# EAGLE schematic Boss DC-2 (EAGLE 7.2.0)
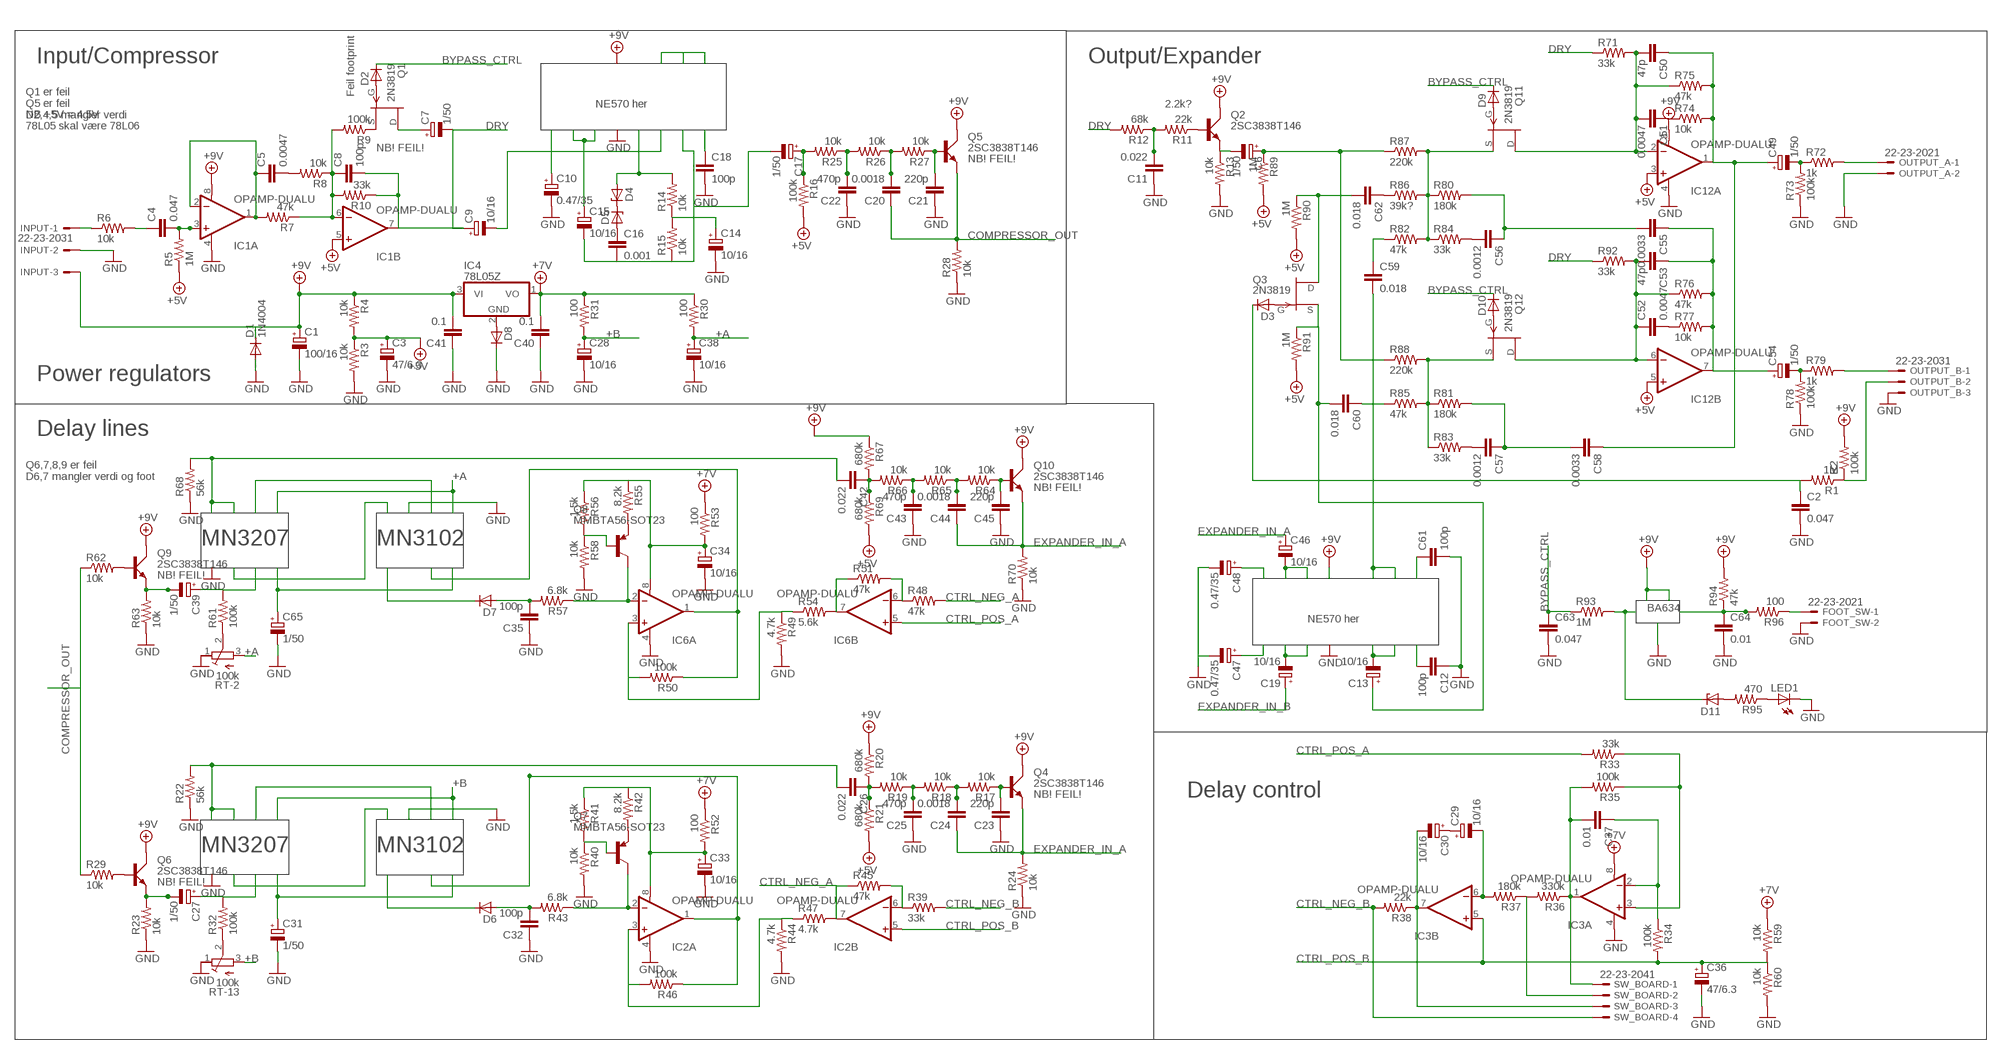
[diagram p0: schematic, sheet 1]

## Parts
C1  100/16  CPOL-EUE2.5-5  [E2,5-5]
C2  0.047  C-EUC0805  [C0805]
C3  47/6.3  CPOL-EUE2.5-5  [E2,5-5]
C4  0.047  C-EUC0805  [C0805]
C5  0.0047  C-EUC0805  [C0805]
C6  1/50  CPOL-EUE2.5-5  [E2,5-5]
C7  1/50  CPOL-EUE2.5-5  [E2,5-5]
C8  100p  C-EUC0805  [C0805]
C9  10/16  CPOL-EUE2.5-5  [E2,5-5]
C10  0.47/35  CPOL-EUE2.5-5  [E2,5-5]
C11  0.022  C-EUC0805  [C0805]
C12  100p  C-EUC0805  [C0805]
C13  10/16  CPOL-EUE2.5-5  [E2,5-5]
C14  10/16  CPOL-EUE2.5-5  [E2,5-5]
C15  10/16  CPOL-EUE2.5-5  [E2,5-5]
C16  0.001  C-EUC0805  [C0805]
C17  1/50  CPOL-EUE2.5-5  [E2,5-5]
C18  100p  C-EUC0805  [C0805]
C19  10/16  CPOL-EUE2.5-5  [E2,5-5]
C20  0.0018  C-EUC0805  [C0805]
C21  220p  C-EUC0805  [C0805]
C22  470p  C-EUC0805  [C0805]
C23  220p  C-EUC0805  [C0805]
C24  0.0018  C-EUC0805  [C0805]
C25  470p  C-EUC0805  [C0805]
C26  0.022  C-EUC0805  [C0805]
C27  1/50  CPOL-EUE2.5-5  [E2,5-5]
C28  10/16  CPOL-EUE2.5-5  [E2,5-5]
C29  10/16  CPOL-EUE2.5-5  [E2,5-5]
C30  10/16  CPOL-EUE2.5-5  [E2,5-5]
C31  1/50  CPOL-EUE2.5-5  [E2,5-5]
C32  100p  C-EUC0805  [C0805]
C33  10/16  CPOL-EUE2.5-5  [E2,5-5]
C34  10/16  CPOL-EUE2.5-5  [E2,5-5]
C35  100p  C-EUC0805  [C0805]
C36  47/6.3  CPOL-EUE2.5-5  [E2,5-5]
C37  0.01  C-EUC0805  [C0805]
C38  10/16  CPOL-EUE2.5-5  [E2,5-5]
C39  1/50  CPOL-EUE2.5-5  [E2,5-5]
C40  0.1  C-EUC0805  [C0805]
C41  0.1  C-EUC0805  [C0805]
C42  0.022  C-EUC0805  [C0805]
C43  470p  C-EUC0805  [C0805]
C44  0.0018  C-EUC0805  [C0805]
C45  220p  C-EUC0805  [C0805]
C46  10/16  CPOL-EUE2.5-5  [E2,5-5]
C47  0.47/35  CPOL-EUE2.5-5  [E2,5-5]
C48  0.47/35  CPOL-EUE2.5-5  [E2,5-5]
C49  1/50  CPOL-EUE2.5-5  [E2,5-5]
C50  47p  C-EUC0805  [C0805]
C51  0.0047  C-EUC0805  [C0805]
C52  0.0047  C-EUC0805  [C0805]
C53  47p  C-EUC0805  [C0805]
C54  1/50  CPOL-EUE2.5-5  [E2,5-5]
C55  0.0033  C-EUC0805  [C0805]
C56  0.0012  C-EUC0805  [C0805]
C57  0.0012  C-EUC0805  [C0805]
C58  0.0033  C-EUC0805  [C0805]
C59  0.018  C-EUC0805  [C0805]
C60  0.018  C-EUC0805  [C0805]
C61  100p  C-EUC0805  [C0805]
C62  0.018  C-EUC0805  [C0805]
C63  0.047  C-EUC0805  [C0805]
C64  0.01  C-EUC0805  [C0805]
C65  1/50  CPOL-EUE2.5-5  [E2,5-5]
D1  1N4004  [DO41-10]
D2  D-SOD-80  [SOD80]
D3  D-SOD-80  [SOD80]
D4  ZENER-DIODESMB  [SMB]
D5  ZENER-DIODESMB  [SMB]
D6  D-SOD-80  [SOD80]
D7  D-SOD-80  [SOD80]
D8  D-SOD-80  [SOD80]
D9  D-SOD-80  [SOD80]
D10  D-SOD-80  [SOD80]
D11  ZENER-DIODESMB  [SMB]
FOOT_SW  22-23-2021  [22-23-2021]
IC1  OPAMP-DUALU  [SO08]
IC2  OPAMP-DUALU  [SO08]
IC3  OPAMP-DUALU  [SO08]
IC4  78L05Z  [TO92]
IC6  OPAMP-DUALU  [SO08]
IC12  OPAMP-DUALU  [SO08]
INPUT  22-23-2031  [22-23-2031]
LED1  LED3MM  [LED3MM]
OUTPUT_A  22-23-2021  [22-23-2021]
OUTPUT_B  22-23-2031  [22-23-2031]
Q1  2N3819  [TO92]
Q2  2SC3838T146  [SC59]
Q3  2N3819  [TO92]
Q4  2SC3838T146  [SC59]
Q5  2SC3838T146  [SC59]
Q6  2SC3838T146  [SC59]
Q7  MMBTA56-SOT23  [SOT23]
Q8  MMBTA56-SOT23  [SOT23]
Q9  2SC3838T146  [SC59]
Q10  2SC3838T146  [SC59]
Q11  2N3819  [TO92]
Q12  2N3819  [TO92]
R1  1M  R-US_R0805  [R0805]
R2  100k  R-US_R0805  [R0805]
R3  10k  R-US_R0805  [R0805]
R4  10k  R-US_R0805  [R0805]
R5  1M  R-US_R0805  [R0805]
R6  10k  R-US_R0805  [R0805]
R7  47k  R-US_R0805  [R0805]
R8  10k  R-US_R0805  [R0805]
R9  100k  R-US_R0805  [R0805]
R10  33k  R-US_R0805  [R0805]
R11  22k  R-US_R0805  [R0805]
R12  68k  R-US_R0805  [R0805]
R13  10k  R-US_R0805  [R0805]
R14  10k  R-US_R0805  [R0805]
R15  10k  R-US_R0805  [R0805]
R16  100k  R-US_R0805  [R0805]
R17  10k  R-US_R0805  [R0805]
R18  10k  R-US_R0805  [R0805]
R19  10k  R-US_R0805  [R0805]
R20  680k  R-US_R0805  [R0805]
R21  680k  R-US_R0805  [R0805]
R22  56k  R-US_R0805  [R0805]
R23  10k  R-US_R0805  [R0805]
R24  10k  R-US_R0805  [R0805]
R25  10k  R-US_R0805  [R0805]
R26  10k  R-US_R0805  [R0805]
R27  10k  R-US_R0805  [R0805]
R28  10k  R-US_R0805  [R0805]
R29  10k  R-US_R0805  [R0805]
R30  100  R-US_R0805  [R0805]
R31  100  R-US_R0805  [R0805]
R32  100k  R-US_R0805  [R0805]
R33  33k  R-US_R0805  [R0805]
R34  100k  R-US_R0805  [R0805]
R35  100k  R-US_R0805  [R0805]
R36  330k  R-US_R0805  [R0805]
R37  180k  R-US_R0805  [R0805]
R38  22k  R-US_R0805  [R0805]
R39  33k  R-US_R0805  [R0805]
R40  10k  R-US_R0805  [R0805]
R41  1.5k  R-US_R0805  [R0805]
R42  8.2k  R-US_R0805  [R0805]
R43  6.8k  R-US_R0805  [R0805]
R44  4.7k  R-US_R0805  [R0805]
R45  47k  R-US_R0805  [R0805]
R46  100k  R-US_R0805  [R0805]
R47  4.7k  R-US_R0805  [R0805]
R48  47k  R-US_R0805  [R0805]
R49  4.7k  R-US_R0805  [R0805]
R50  100k  R-US_R0805  [R0805]
R51  47k  R-US_R0805  [R0805]
R52  100  R-US_R0805  [R0805]
R53  100  R-US_R0805  [R0805]
R54  5.6k  R-US_R0805  [R0805]
R55  8.2k  R-US_R0805  [R0805]
R56  1.5k  R-US_R0805  [R0805]
R57  6.8k  R-US_R0805  [R0805]
R58  10k  R-US_R0805  [R0805]
R59  10k  R-US_R0805  [R0805]
R60  10k  R-US_R0805  [R0805]
R61  100k  R-US_R0805  [R0805]
R62  10k  R-US_R0805  [R0805]
R63  10k  R-US_R0805  [R0805]
R64  10k  R-US_R0805  [R0805]
R65  10k  R-US_R0805  [R0805]
R66  10k  R-US_R0805  [R0805]
R67  680k  R-US_R0805  [R0805]
R68  56k  R-US_R0805  [R0805]
R69  680k  R-US_R0805  [R0805]
R70  10k  R-US_R0805  [R0805]
R71  33k  R-US_R0805  [R0805]
R72  1k  R-US_R0805  [R0805]
R73  100k  R-US_R0805  [R0805]
R74  10k  R-US_R0805  [R0805]
R75  47k  R-US_R0805  [R0805]
R76  47k  R-US_R0805  [R0805]
R77  10k  R-US_R0805  [R0805]
R78  100k  R-US_R0805  [R0805]
R79  1k  R-US_R0805  [R0805]
R80  180k  R-US_R0805  [R0805]
R81  180k  R-US_R0805  [R0805]
R82  47k  R-US_R0805  [R0805]
R83  33k  R-US_R0805  [R0805]
R84  33k  R-US_R0805  [R0805]
R85  47k  R-US_R0805  [R0805]
R86  39k?  R-US_R0805  [R0805]
R87  220k  R-US_R0805  [R0805]
R88  220k  R-US_R0805  [R0805]
R89  1M  R-US_R0805  [R0805]
R90  1M  R-US_R0805  [R0805]
R91  1M  R-US_R0805  [R0805]
R92  33k  R-US_R0805  [R0805]
R93  1M  R-US_R0805  [R0805]
R94  47k  R-US_R0805  [R0805]
R95  470  R-US_R0805  [R0805]
R96  100  R-US_R0805  [R0805]
RT-2  100k  R-TRIMMT93YA  [RTRIMT93YA]
RT-13  100k  R-TRIMMT93YA  [RTRIMT93YA]
SW_BOARD  22-23-2041  [22-23-2041]

## Nets
+5V: C3.+ IC1.5(B:+IN) IC12.3(A:+IN) IC12.5(B:+IN) R3.1 R4.2 R5.1 R16.2 R21.2 R69.2 R89.2 R90.2 R91.2
+7V: C40.2 IC3.8(A:V+) IC4.1(VO) R30.1 R31.1 R52.1 R53.1 R59.1
+9V: C1.+ C41.2 D1.C IC1.8(A:V+) IC4.3(VI) IC12.8(A:V+) INPUT.3 Q2.C Q4.C Q5.C Q6.C Q9.C Q10.C R2.2 R4.1 R20.1 R67.1 R94.2
+A: C38.+ R30.2 RT-2.3(A)
+B: C28.+ R31.2 RT-13.3(A)
BYPASS_CTRL: C63.1 D2.1(C) D9.1(C) D10.1(C) R93.1
COMPRESSOR_OUT: C20.1 Q5.E R28.2 R29.1 R62.1
CTRL_NEG_A: IC2.7(B:OUT) R45.1 R47.2 R48.2
CTRL_NEG_B: R38.2 R39.2 SW_BOARD.4
CTRL_POS_A: IC6.5(B:+IN) R33.2
CTRL_POS_B: C36.+ IC2.5(B:+IN) IC3.5(B:+IN) R34.2 R59.2 R60.1
DRY: C7.- C8.2 C9.+ IC1.7(B:OUT) R10.1 R12.2 R71.1 R92.1
EXPANDER_IN_A: C24.1 C44.1 C46.+ Q4.E Q10.E R24.2 R70.2
EXPANDER_IN_B: C19.+
GND: C1.- C2.2 C3.- C10.- C11.1 C12.1 C14.- C18.2 C21.1 C22.1 C23.1 C25.1 C28.- C31.- C32.1 C33.- C34.- C35.1 C36.- C38.- C40.1 C41.1 C43.1 C45.1 C47.- C48.- C61.2 C63.2 C64.2 C65.- D1.A D8.1(C) FOOT_SW.2 IC1.4(A:V-) IC2.4(A:V-) IC3.4(A:V-) IC6.4(A:V-) IC12.4(A:V-) INPUT.2 LED1.K(C) OUTPUT_A.2 OUTPUT_B.3 R3.2 R13.2 R22.1 R23.1 R24.1 R28.1 R40.2 R44.2 R49.2 R58.2 R60.2 R63.1 R68.1 R70.1 R73.1 R78.1 RT-2.1(E) RT-13.1(E)
N$1: C4.1 R6.2
N$2: C4.2 IC1.3(A:+IN) R5.2
N$3: INPUT.1 R6.1
N$4: C15.+
N$5: C5.2 R8.2
N$6: C5.1 IC1.1(A:OUT) IC1.2(A:-IN) R7.2
N$7: C8.1 IC1.6(B:-IN) R7.1 R8.1 R9.2 R10.2
N$8: Q9.B R62.2
N$9: C16.1 D5.A
N$10: D4.C D5.C
N$11: C14.+ R14.1 R15.2
N$12: D4.A R14.2
N$13: C15.- C16.2 C17.- R15.1
N$14: C18.1
N$15: C10.+
N$16: C9.-
N$17: C17.+ R16.1 R25.2
N$18: C22.2 R25.1 R26.2
N$19: C20.2 R26.1 R27.2
N$20: C21.2 Q5.B R27.1
N$21: Q6.B R29.2
N$22: Q1.3(S) R9.1
N$23: C7.+ Q1.1(D)
N$24: D2.2(A) Q1.2(G)
N$25: C39.- Q9.E R63.2
N$26: C27.- Q6.E R23.2
N$27: C39.+ R61.2
N$28: C27.+ R32.2
N$29: C65.+
N$30: C31.+
N$33: R61.1 RT-2.2(S)
N$34: R32.1 RT-13.2(S)
N$35: C26.2 R22.2
N$36: C42.2 R68.2
N$38: D6.1(C)
N$39: D7.1(C)
N$41: IC6.1(A:OUT) R50.1
N$42: IC2.1(A:OUT) R46.1
N$43: C35.2 D7.2(A) R57.2
N$44: C32.2 D6.2(A) R43.2
N$45: Q8.1(B) R56.2 R58.1
N$46: C34.+ IC6.8(A:V+) R53.2 R55.1 R56.1
N$47: Q8.2(E) R55.2
N$48: IC6.2(A:-IN) Q8.3(C) R57.1
N$49: IC6.3(A:+IN) R49.1 R50.2 R54.1
N$51: Q2.B R11.1
N$52: IC6.7(B:OUT) R51.1 R54.2
N$53: IC6.6(B:-IN) R48.1 R51.2
N$54: C11.2 R11.2 R12.1
N$55: C42.1 R66.2 R67.2 R69.1
N$56: C43.2 R65.2 R66.1
N$57: C44.2 R64.2 R65.1
N$58: C45.2 Q10.B R64.1
N$59: Q7.1(B) R40.1 R41.2
N$60: C33.+ IC2.8(A:V+) R41.1 R42.1 R52.2
N$61: Q7.2(E) R42.2
N$62: IC2.2(A:-IN) Q7.3(C) R43.1
N$63: IC2.3(A:+IN) R44.1 R46.2 R47.1
N$64: FOOT_SW.1 R96.1
N$65: IC2.6(B:-IN) R39.1 R45.2
N$66: C6.+ R87.1 R88.1 R89.1
N$67: C26.1 R19.2 R20.2 R21.1
N$68: C25.2 R18.2 R19.1
N$69: C24.2 R17.2 R18.1
N$70: C23.2 Q4.B R17.1
N$71: C62.1 R86.1
N$72: Q11.3(S) R80.1 R82.2 R84.1 R86.2 R87.2
N$73: C56.2 R84.2
N$74: C59.1 R82.1
N$75: C59.2
N$76: C62.2 Q3.1(D) R90.1
N$77: D3.2(A) Q3.2(G)
N$78: C13.+ C60.2 Q3.3(S) R91.1
N$79: C60.1 R85.1
N$80: C49.- R72.1 R73.2
N$81: D9.2(A) Q11.2(G)
N$82: Q12.3(S) R81.1 R83.1 R85.2 R88.2
N$83: C57.2 R83.2
N$84: C53.1 C54.+ C55.1 IC12.7(B:OUT) R76.2 R77.2
N$85: D10.2(A) Q12.2(G)
N$86: C57.1 C58.2 R81.2
N$87: C55.2 C56.1 R80.2
N$88: C2.1 D3.1(C) R1.2
N$89: C51.1 R74.1
N$90: C52.2 R77.1
N$91: C52.1 C53.2 Q12.1(D) R76.1 R92.2
N$92: C50.2 C51.2 Q11.1(D) R71.2 R75.1
N$93: C49.+ C50.1 C58.1 IC12.1(A:OUT) R74.2 R75.2
N$94: C54.- R78.2 R79.1
N$95: OUTPUT_B.2 R1.1 R2.1
N$96: C19.-
N$97: OUTPUT_B.1 R79.2
N$98: OUTPUT_A.1 R72.2
N$99: C61.1
N$100: C48.+
N$101: C12.2
N$102: C47.+
N$103: C13.-
N$104: C30.- IC3.7(B:OUT) R38.1 SW_BOARD.3
N$105: C29.- IC3.6(B:-IN) R37.2
N$106: C46.-
N$107: R36.2 R37.1 SW_BOARD.2
N$108: C37.2 IC3.1(A:OUT) R35.2 R36.1 SW_BOARD.1
N$109: C64.1 R94.1 R96.2
N$110: C29.+ C30.+
N$111: C37.1 IC3.2(A:-IN) R34.1
N$112: IC3.3(A:+IN) R33.1 R35.1
N$113: LED1.A R95.1
N$114: D11.A R95.2
N$115: D11.C R93.2
N$116: D8.2(A) IC4.2(GND)
N$117: C6.- Q2.E R13.1
Unconnected: IC12.2(A:-IN) IC12.6(B:-IN)

## Notes on the sheet
- Input/Compressor | Output/Expander
- Feil footprint
- NE570 her | 2.2k?
- Q1 er feil
  Q5 er feil
  D2,4,5 mangler verdi
- NB +5V = 4.5V
  78L05 skal være 78L06
- NB! FEIL!
- NB! FEIL!
- Power regulators
- Delay lines
- Q6,7,8,9 er feil
  D6,7 mangler verdi og foot
- NB! FEIL!
- MN3207 | MN3102
- NB! FEIL!
- BA634
- NE570 her
- NB! FEIL! | Delay control
- MN3207 | MN3102
- NB! FEIL!

## Library data of the parts
C1 C3 C6 C7 C9 C10 C13-C15 C17 C19 C27-C31 C33 C34 C36 C38 C39 C46-C49 C54 C65 = resistor:CPOL-EU: POLARIZED CAPACITOR, European symbol
C2 C4 C5 C8 C11 C12 C16 C18 C20-C26 C32 C35 C37 C40-C45 C50-C53 C55-C64 = resistor:C-EU: CAPACITOR, European symbol
D1 = diode:1N4004: DIODE general purpose rectifier, 1 A
D2 D3 D6-D10 = semicon-smd-ipc:D-: DIODE unfilled
D4 D5 D11 = diode:ZENER-DIODE: Z-Diode
FOOT_SW OUTPUT_A = con-molex:22-23-2021: .100" (2.54mm) Center Header - 2 Pin; MF: MOLEX; MPN: 22-23-2021; OC_FARNELL: 1462926; OC_NEWARK: 25C3832
IC1-IC3 IC6 IC12 = SparkFun:OPAMP-DUAL: Operational Amplifier
IC4 = linear:78*: Positive VOLTAGE REGULATOR Source: http://cache.national.com/ds/LM/LM78L05.pdf http://www.fairchildsemi.com/ds/LM/LM7805.pdf
INPUT OUTPUT_B = con-molex:22-23-2031: .100" (2.54mm) Center Header - 3 Pin; MF: MOLEX; MPN: 22-23-2031; OC_FARNELL: 1462950; OC_NEWARK: 30C0862
LED1 = led:LED: LED OSRAM: - CHIPLED LG R971, LG N971, LY N971, LG Q971, LY Q971, LO R971, LY R971 LH N974, LH R974 LS Q976, LO Q976, LY Q976 LO Q996 - Hyper CHIPLED LW Q18S LB Q993, LB Q99A, LB R99A - SideLED LS A670, LO A670, LY A670, LG A670, LP A670 LB A673, LV A673, LT A673, LW A673 LH A674 LY A675 LS A676, LA A676, LO A676, LY A676, LW A676 LS A679, LY A679, LG A679 - Hyper Micro SIDELED® LS Y876, LA Y876, LO Y876, LY Y876 LT Y87S - SmartLED LW L88C, LW L88S LB L89C, LB L89S, LG L890 LS L89K, LO L89K, LY L89K LS L896, LA L896, LO L896, LY L896 - TOPLED LS T670, LO T670, LY T670, LG T670, LP T670 LSG T670, LSP T670, LSY T670, LOP T670, LYG T670 LG T671, LOG T671, LSG T671 LB T673, LV T673, LT T673, LW T673 LH T674 LS T676, LA T676, LO T676, LY T676, LB T676, LH T676, LSB T676, LW T676 LB T67C, LV T67C, LT T67C, LS T67K, LO T67K, LY T67K, LW E67C LS E67B, LA E67B, LO E67B, LY E67B, LB E67C, LV E67C, LT E67C LW T67C LS T679, LY T679, LG T679 LS T770, LO T770, LY T770, LG T770, LP T770 LB T773, LV T773, LT T773, LW T773 LH T774 LS E675, LA E675, LY E675, LS T675 LS T776, LA T776, LO T776, LY T776, LB T776 LHGB T686 LT T68C, LB T68C - Hyper Mini TOPLED® LB M676 - Mini TOPLED Santana® LG M470 LS M47K, LO M47K, LY M47K Source: http://www.osram.convergy.de LUXEON: - LUMILED® LXK2-PW12-R00, LXK2-PW12-S00, LXK2-PW14-U00, LXK2-PW14-V00 LXK2-PM12-R00, LXK2-PM12-S00, LXK2-PM14-U00 LXK2-PE12-Q00, LXK2-PE12-R00, LXK2-PE12-S00, LXK2-PE14-T00, LXK2-PE14-U00 LXK2-PB12-K00, LXK2-PB12-L00, LXK2-PB12-M00, LXK2-PB14-N00, LXK2-PB14-P00, LXK2-PB14-Q00 LXK2-PR12-L00, LXK2-PR12-M00, LXK2-PR14-Q00, LXK2-PR14-R00 LXK2-PD12-Q00, LXK2-PD12-R00, LXK2-PD12-S00 LXK2-PH12-R00, LXK2-PH12-S00 LXK2-PL12-P00, LXK2-PL12-Q00, LXK2-PL12-R00 Source: www.luxeon.com KINGBRIGHT: KA-3528ASYC Source: www.kingbright.com
Q1 Q3 Q11 Q12 = transistor-fet:2N3819: N-Channel Junction FET
Q2 Q4-Q6 Q9 Q10 = transistor-small-signal:2SC3838: High-Frequency Amplifier Transistor 11V, 50mA, 3.2GHz (Rohm)
Q7 Q8 = transistor-pnp:*-?: PNP Transistor
R1-R96 = resistor:R-US_: RESISTOR, American symbol
RT-2 RT-13 = resistor:R-TRIMM: Trimm resistor
SW_BOARD = con-molex:22-23-2041: .100" (2.54mm) Center Header - 4 Pin; MF: MOLEX; MPN: 22-23-2041; OC_FARNELL: 1462920; OC_NEWARK: 38C0355